# Altium schematic sheet PowerManagement.SchDoc
size 420 x 297 mm; DocumentNumber: PowerManagement
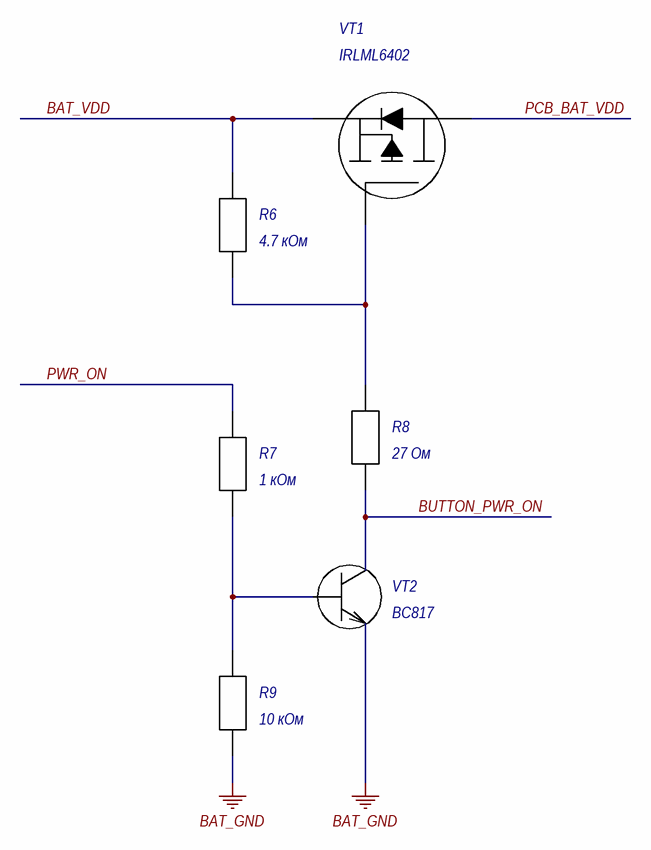
[diagram p0: PowerManagement.SchDoc]

## Parts
R6  4.7 кОм  [RES 0402]
R7  1 кОм  [RES 0402]
R8  27 Ом  [RES 0402]
R9  10 кОм  [RES 0402]
VT1  IRLML6402  [SOT-23]
VT2  BC817  [SOT-23]

## Nets
BAT_GND: R9.1 VT2.2(E)
BAT_VDD: R6.2 VT1.2(S)
BUTTON_PWR_ON: R8.1 VT2.3(C)
PCB_BAT_VDD: VT1.3(D)
PWR_ON: R7.2
NetR6_1: R6.1 R8.2 VT1.1(G)
NetR7_1: R7.1 R9.2 VT2.1(B)

## Notes on the sheet
- Подп. и дата
- Инв. № дубл.
- Взам. инв. №
- Инв. № подл.
- Лист
- Изм.
- № докум.
- Подп.
- Дата
- Копировал
- Формат А3

## Library data of the parts
R6-R9 = RES 0402
VT2 = BC817: NPN general-purpose transistor; Manufacturer: NXP; Structure: n-p-n; Type: Транзистор биполярный; hFE: 160 ... 600; Max collector-emitter voltage: 45 В; Max collector-base voltage: 50 В; Max emitter-base voltage: 5 В; Max collector current: 0,5 А; Max collector peak current: 1 А; Power dissitipation: 0,25 Вт; fT: 100 МГц; Collector-emitter saturation voltage: 0,7 В; Base-emitter on voltage: 1,2 В; Specitication: ЭКБ ИП; Collector-base сapacitance: 3 пФ; Complement: BC807; Temperature range: -65 ... 150 °C